# EAGLE design Tractive System Active Light rev2 (EAGLE 9.5.2)
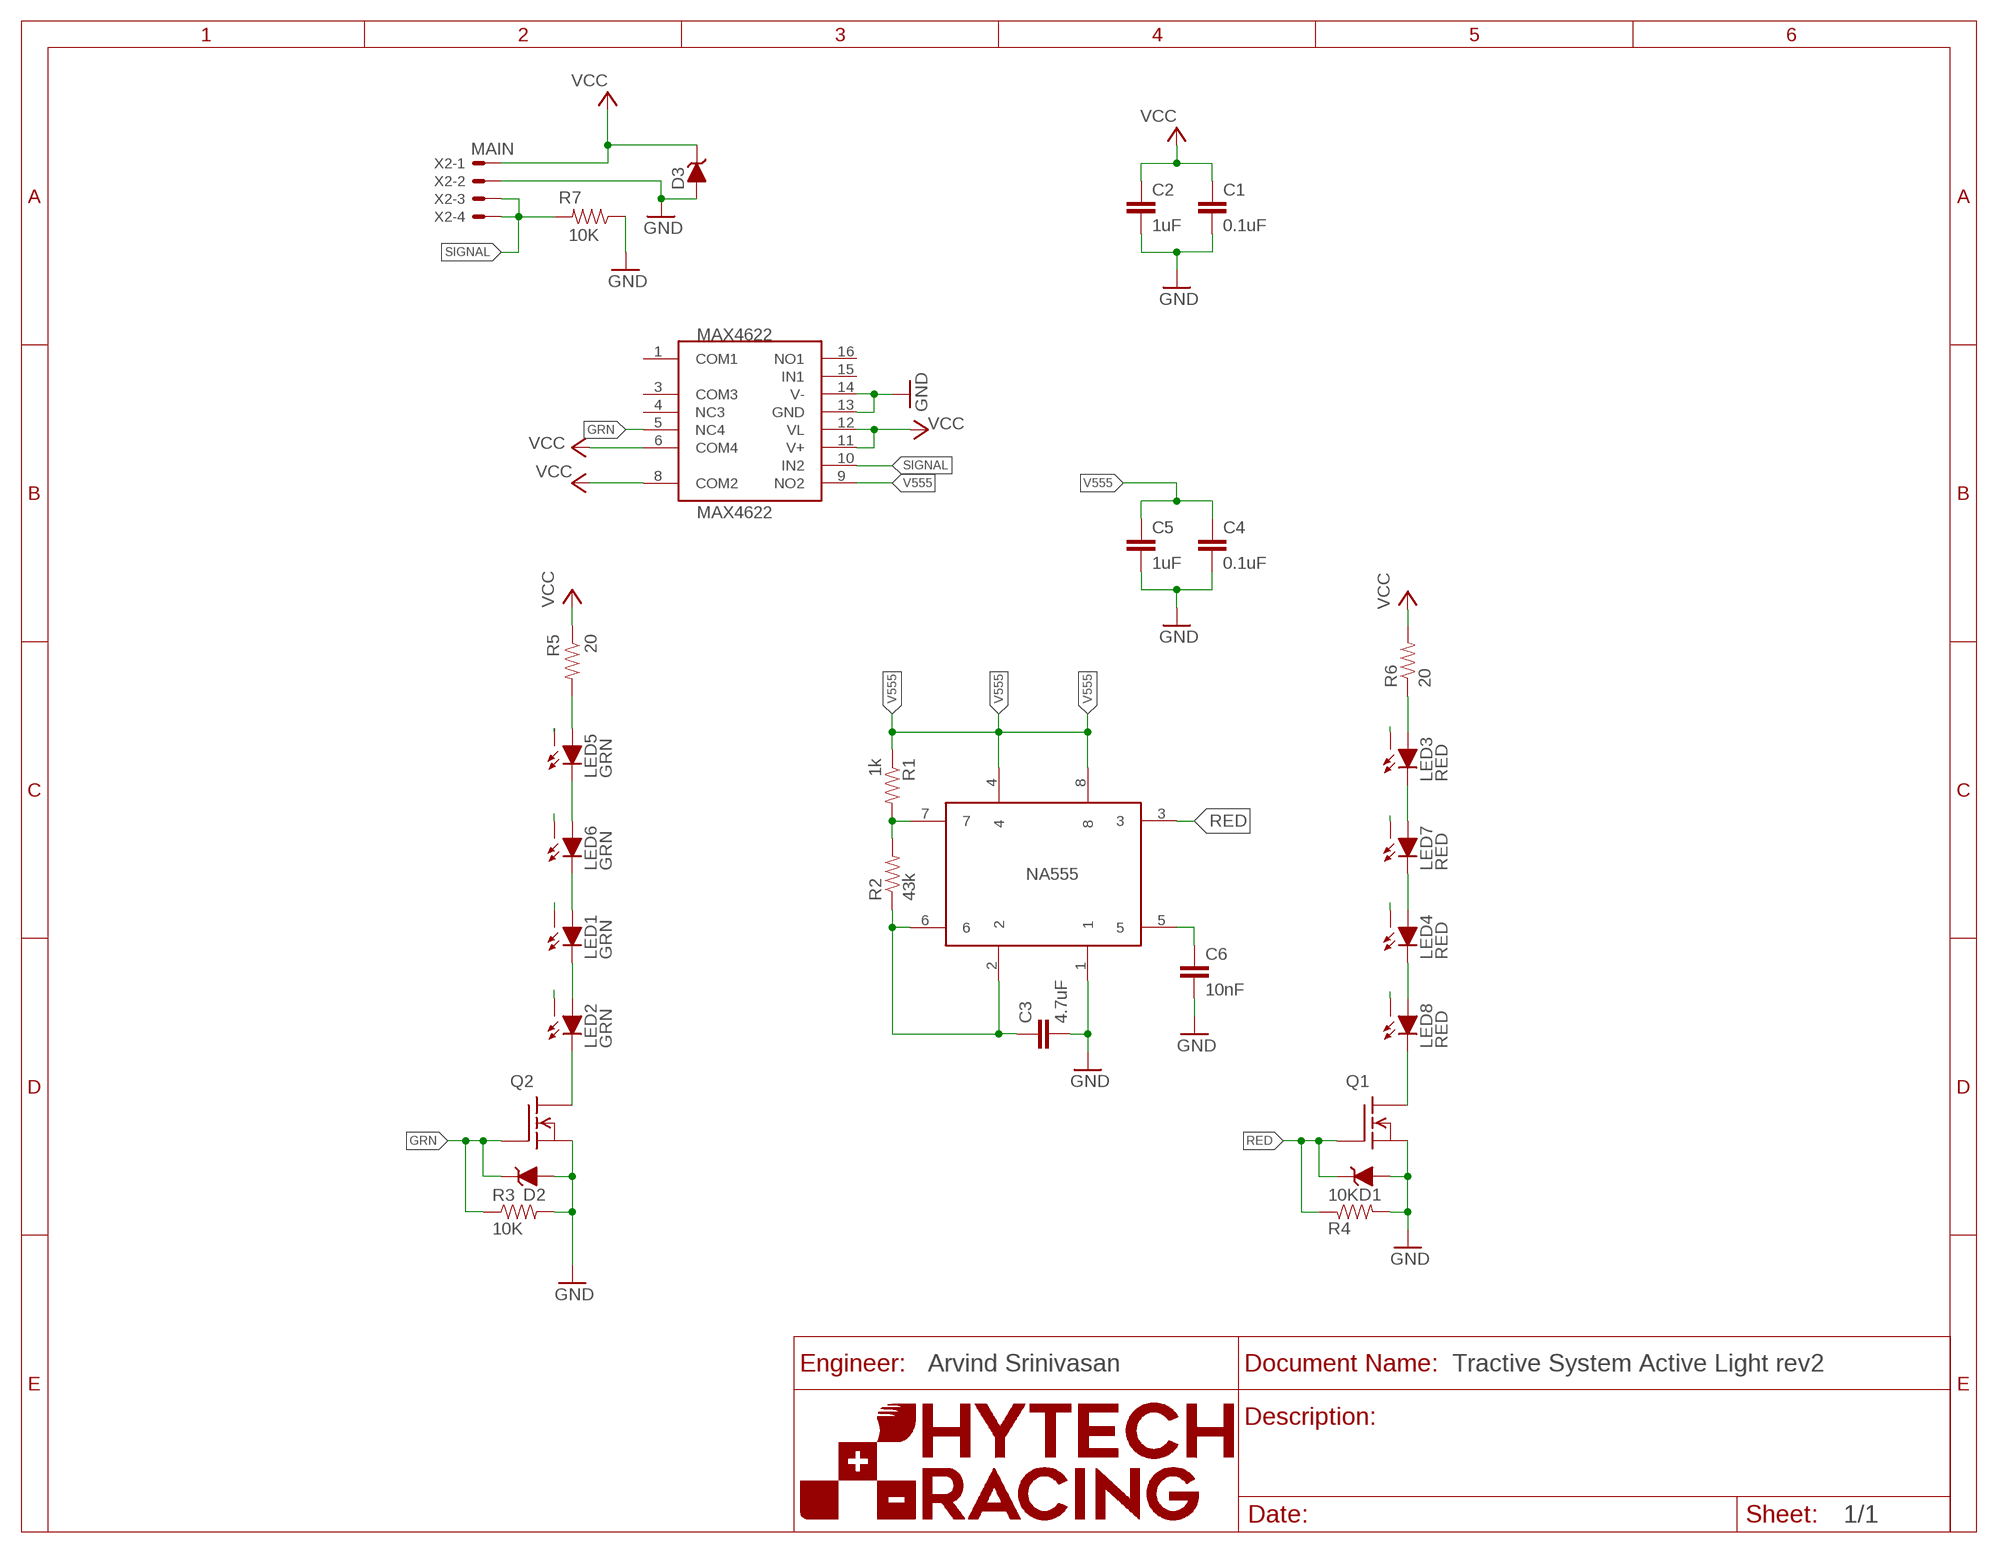
[diagram p0: schematic, sheet 1]
U$1 (FRAME_A_L): ORIENTATION: LANDSCAPE; SIZE: A

## Parts
C1  0.1uF  CAP0603-CAP  [0603-CAP]
C2  1uF  CAP0603-CAP  [0603-CAP]
C3  4.7uF  CAP0603-CAP  [0603-CAP]
C4  0.1uF  CAP0603-CAP  [0603-CAP]
C5  1uF  CAP0603-CAP  [0603-CAP]
C6  10nF  CAP0603-CAP  [0603-CAP]
D1  DIODE_ZENER  [SOT23]
D2  DIODE_ZENER  [SOT23]
D3  DIODE_ZENER0603  [0603_D]
LED1  GRN  XP-E2XP-E2  [XP-E2]
LED2  GRN  XP-E2XP-E2  [XP-E2]
LED3  RED  XP-E2XP-E2  [XP-E2]
LED4  RED  XP-E2XP-E2  [XP-E2]
LED5  GRN  XP-E2XP-E2  [XP-E2]
LED6  GRN  XP-E2XP-E2  [XP-E2]
LED7  RED  XP-E2XP-E2  [XP-E2]
LED8  RED  XP-E2XP-E2  [XP-E2]
MAX4622  MAX4622  [SO16]
NA555  NA555SO-8  [SOIC-08]
Q1  DMG3406LSOT  [SOT23]
Q2  DMG3406LSOT  [SOT23]
R1  1k  RESISTOR0603-RES  [0603-RES]
R2  43k  RESISTOR0603-RES  [0603-RES]
R3  10K  RESISTOR0603-RES  [0603-RES]
R4  10K  RESISTOR0603-RES  [0603-RES]
R5  20  RESISTOR0603-RES  [0603-RES]
R6  20  RESISTOR0603-RES  [0603-RES]
R7  10K  RESISTOR0603-RES  [0603-RES]
X2  MAIN  CONNECTOR-4NANO-FIT_RIGHT_ANGLE-4-SURFACE  [NANO-FIT_RIGHT_ANGLE-4-SURFACE]

## Nets
GND: C1.2 C2.2 C3.2 C4.2 C5.2 C6.2 D1.1(A) D2.1(A) D3.A MAX4622.13(GND) MAX4622.14(V-) NA555.1 Q1.2(S) Q2.2(S) R3.2 R4.2 R7.1 X2.2
GRN: D2.3(C) MAX4622.5(NC4) Q2.1(G) R3.1
N$1: LED1.A LED6.C
N$2: LED2.C Q2.3(D)
N$3: LED5.C LED6.A
N$5: LED5.A R5.2
N$8: C3.1 NA555.2 NA555.6 R2.1
N$9: NA555.7 R1.2 R2.2
N$10: LED8.C Q1.3(D)
N$11: LED3.A R6.1
N$13: C6.1 NA555.5
N$16: LED1.C LED2.A
N$17: LED3.C LED7.A
N$18: LED4.A LED7.C
N$19: LED4.C LED8.A
RED: D1.3(C) NA555.3 Q1.1(G) R4.1
SIGNAL: MAX4622.10(IN2) R7.2 X2.3 X2.4
THERM: LED1.X LED2.X LED3.X LED4.X LED5.X LED6.X LED7.X LED8.X
V555: C4.1 C5.1 MAX4622.9(NO2) NA555.4 NA555.8 R1.1
VCC: C1.1 C2.1 D3.C MAX4622.6(COM4) MAX4622.8(COM2) MAX4622.11(V+) MAX4622.12(VL) R5.1 R6.2 X2.1
Unconnected: MAX4622.1(COM1) MAX4622.3(COM3) MAX4622.4(NC3) MAX4622.15(IN1) MAX4622.16(NO1)

## Notes on the sheet
- Arvind Srinivasan

## Library data of the parts
C1-C6 = HyTechDevices:CAP: Capacitor Standard 0603 ceramic capacitor, and 0.1" leaded capacitor.; TOLERANCE: 5%; VOLTAGE: 25V
D1-D3 = HyTechDevices:DIODE_ZENER: ZENER DIODE
LED1-LED8 = HyTechDevices:XP-E2: XP-E2 high-brightness LED. Data sheet <https://www.cree.com/led-components/media/documents/XLampXPE2.pdf>
MAX4622 = HyTechDevices:MAX4622: Maxim Integrated MAX 4622 analogue switch. Data sheet <https://datasheets.maximintegrated.com/en/ds/MAX4621-MAX4623.pdf>
NA555 = HyTechDevices:NA555: Texas Instruments NA555 timer. Data sheet <http://www.ti.com/lit/ds/symlink/se555.pdf>
Q1 Q2 = HyTechDevices:DMG3406L: Generic NPN MOSFET DMG3406L (SOT-23, 2.8 A 30V)
R1-R7 = HyTechDevices:RESISTOR: Resistor Basic schematic elements and footprints for 0603, 1206, and PTH resistors.; TOLERANCE: 1%
X2 = HyTechDevices:CONNECTOR-4: Mini-Fit Junior connector 4 pole Source: http://www.molex.com

## Board
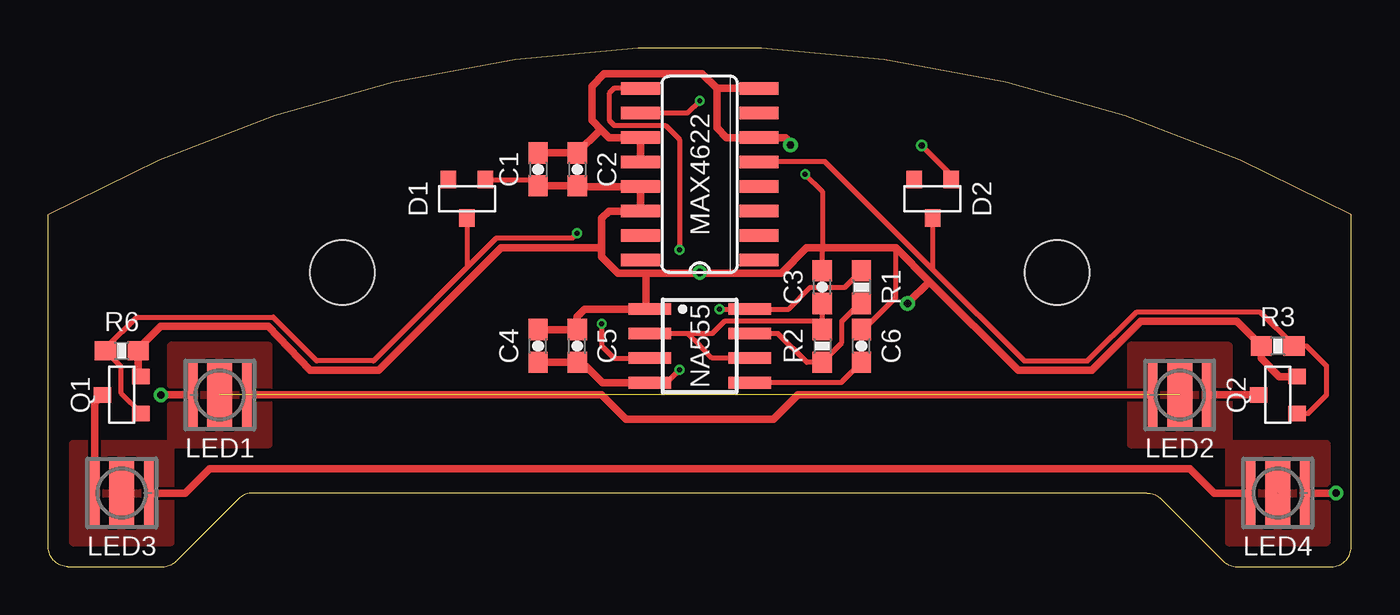
[diagram p1: board, top side]
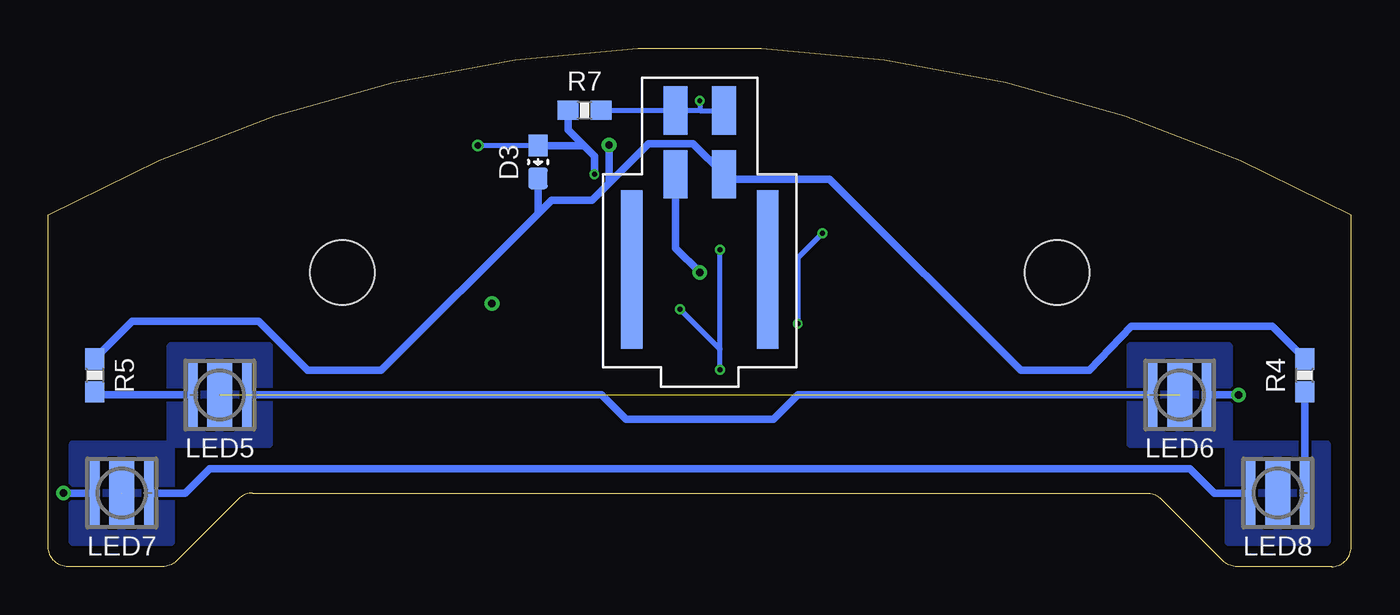
[diagram p2: board, bottom side, seen from below]

Size 67.51 x 26.85 mm. Coordinates in mm from the lower left corner, seen from the top.
Outline: 57.65,3.51 60.87,0.3 arc45 61.58,0 66.5,0 arc90 67.51,1.02 67.51,18.22 arc58 0,18.22 0,1.02 arc90 1.02,0 5.93,0 arc45 6.65,0.3 9.86,3.51 arc-45 10.58,3.81 56.93,3.81 arc-45 57.65,3.51
Copper layers (1*16): Top 0.035559375mm / dielectric 1.6mm / Bottom 0.035559375mm
Design rules "DRC Oshpark": minimum track width 6mil, minimum drill 10mil, track to track 6mil, track to pad 6mil, pad to pad 6mil, via to via 6mil, smd to smd 6mil, copper to edge 15mil, drill to drill 6mil, minimum pad ring 5mil, minimum via ring 5mil, stop-mask expansion 2.5mil, vias tented up to drill 30mil, thermal gap 10mil

### Footprints (pad centres in the part's own frame; a part is rotated, then mirrored left to right if it is on the bottom)
M3_MOUNTING = hole 3.353: 0,0
0603-CAP = smd 1.1 x 1: 1 -0.85,0; 2 0.85,0
SOT23 = smd 0.8 x 0.9: 1 -0.95,-1; 2 0.95,-1; 3 0,1
0603_D = smd 1.1 x 1: A -0.85,0; C 0.85,0
XP-E2 = smd 0.5 x 3.3: A -1.4,0; C 1.4,0 | smd 1.3 x 3.3: X 0,0
SO16 = smd 0.66 x 2.032: 1 -4.445,-3.073; 2 -3.175,-3.073; 3 -1.905,-3.073; 4 -0.635,-3.073; 5 0.635,-3.073; 6 1.905,-3.073; 7 3.175,-3.073; 8 4.445,-3.073; 9 4.445,3.073; 10 3.175,3.073; 11 1.905,3.073; 12 0.635,3.073; 13 -0.635,3.073; 14 -1.905,3.073; 15 -3.175,3.073; 16 -4.445,3.073
SOIC-08 = smd 0.6 x 2.2: 1 -1.905,-2.6; 2 -0.635,-2.6; 3 0.635,-2.6; 4 1.905,-2.6; 5 1.905,2.6; 6 0.635,2.6; 7 -0.635,2.6; 8 -1.905,2.6
0603-RES = smd 1.1 x 1: 1 -0.85,0; 2 0.85,0
NANO-FIT_RIGHT_ANGLE-4-SURFACE = smd 1.24 x 2.5: 1 1.25,0; 2 -1.25,0; 3 1.25,3.3; 4 -1.25,3.3 | smd 1.1 x 8.2: P$5 -3.52,-4.93; P$6 3.52,-4.93

### Placement (x,y rotation side)
$$U$1  [M3_MOUNTING]  15.24,15.24 0 top
C1  25.37,20.57 270 top
C2  27.41,20.57 270 top
C3  40.11,14.48 90 top
C4  25.37,11.43 90 top
C5  27.41,11.43 90 top
C6  42.14,11.43 90 top
D1  21.69,19.05 180 top
D2  45.82,19.05 180 top
D3  42.14,20.96 270 bottom
LED1  8.89,8.89 0 top
LED2  58.62,8.89 0 top
LED3  3.81,3.81 180 bottom
LED4  63.7,3.81 180 top
LED5  58.62,8.89 0 bottom
LED6  8.89,8.89 0 bottom
LED7  63.7,3.81 180 bottom
LED8  3.81,3.81 180 top
MAX4622  33.76,20.32 90 top
NA555  33.76,11.43 270 top
Q1  3.81,8.89 90 top
Q2  63.7,8.89 90 top
R1  42.14,14.48 270 top
R2  40.11,11.43 270 top
R3  63.7,11.43 180 top
R4  3.81,11.18 0 top
R5  65.1,9.91 270 bottom
R6  2.41,9.91 90 bottom
R7  39.73,23.63 0 bottom
U$2  [M3_MOUNTING]  52.27,15.24 0 top
X2  33.76,20.32 0 bottom

### Tracks (layer width: path | path; a pad name or v marks a point on that pad's centre or on a via)
GND  (via drill 0.25 pad 0.51, 0.35, 0.38 pad 0.76)
  Top 0.254: v39.22,20.32 40.11,19.43 40.11,16.51 C3.2 | 43.92,16.51 43.92,13.96 42.24,12.28 C6.2 | D1.1 25.33,20.05 25.66,19.72 | v45.26,21.81 46.77,20.3 D2.1
  Top 0.381: 45.66,14.77 50.27,10.16 54.08,10.16 56.62,12.7 61.58,12.7 R3.2 62.85,10.78 63.79,9.84 Q2.2 | 45.66,14.77 43.92,16.51 40.11,16.51 39.3,16.51 37.99,15.2 33.76,15.2 | 28.68,16.51 23.47,16.51 17.12,10.16 13.56,10.16 11.39,12.45 5.82,12.45 4.55,11.18 R4.2 4.66,9.99 Q1.2 | 30.96,15.2 29.53,15.2 28.68,16.05 28.68,16.51 | 30.96,15.2 33.76,15.2 | 33.76,15.2 v33.76,15.24 | 28.68,16.51 28.68,18.03 29.06,18.41 MAX4622.14 MAX4622.13 27.45,19.68 C2.2 25.66,19.72 C1.2 | 30.96,15.2 30.96,13.53 NA555.1 27.79,13.34 27.41,12.95 C5.2 C4.2 | 45.66,14.77 | 45.66,14.77 v44.52,13.63
  Bottom 0.254: X2.2 | D3.A v45.26,21.81
  Bottom 0.381: X2.2 35.02,16.5 v33.76,15.24 | v39.22,20.32 39.22,21.27 39.76,21.81 | R7.1 40.58,22.63 39.76,21.81 | D3.A 39.76,21.81
GRN
  Top 0.254: 45.82,15.4 50.57,10.65 53.85,10.65 56.37,13.17 62.81,13.17 R3.1 65.19,11.43 66.24,10.38 66.24,8.89 65.29,7.94 Q2.1 | 45.82,15.4 40.25,20.98 37.36,20.98 37.34,20.95 MAX4622.5 | D2.3 45.82,15.4
N$1  (via drill 0.38 pad 0.76)
  Top 0.381: v5.84,8.89 LED6.C
  Bottom 0.381: LED6.C v5.84,8.89
N$2
  Top 0.381: Q2.3 LED2.C
N$3
  Bottom 0.381: LED6.A 28.68,8.89 29.95,7.62 37.57,7.62 38.84,8.89 LED5.C
N$5
  Bottom 0.381: R5.2 64.94,8.89 LED5.A
N$8
  Top 0.254: C3.1 R2.1 39.69,12.7 35.03,12.7 34.39,12.06 33.12,12.06 | NA555.6 34.39,10.79 33.76,11.43 33.12,12.06 | 33.12,12.06 NA555.2
N$9
  Top 0.254: R1.2 42.04,13.63 41.12,12.71 41.12,11.6 R2.2 39.31,10.58 37.82,12.06 NA555.7
N$10
  Top 0.381: LED8.C 2.41,8.49 Q1.3
N$11
  Bottom 0.381: R6.1 LED3.A
N$13
  Top 0.254: C6.1 41.08,9.52 NA555.5
N$16
  Top 0.381: LED1.C 28.68,8.89 29.95,7.62 37.57,7.62 38.84,8.89 LED2.A
N$17
  Bottom 0.381: LED7.A 60.43,3.81 59.16,5.08 8.36,5.08 7.09,3.81 LED3.C
N$18  (via drill 0.38 pad 0.76)
  Top 0.381: LED4.A v66.73,3.81
  Bottom 0.381: v66.73,3.81 LED4.A
N$19
  Top 0.381: LED4.C 60.43,3.81 59.16,5.08 8.36,5.08 7.09,3.81 LED8.A
RED  (via drill 0.25 pad 0.51)
  Top 0.254: 21.69,15.49 23.22,17.02 27.15,17.02 v27.41,17.27 | v28.68,12.57 28.68,11.43 29.31,10.79 NA555.3 | Q1.1 3.78,8.96 3.78,10.35 R4.1 2.96,11.3 4.57,12.92 11.65,12.92 13.92,10.65 16.85,10.65 21.55,15.36 21.69,15.49 | D1.3 21.69,15.49
  Bottom 0.254: v27.41,17.27 28.68,16 v28.68,12.57
SIGNAL  (via drill 0.25 pad 0.51)
  Top 0.254: MAX4622.10 33.12,23.49 v33.76,24.13
  Bottom 0.254: v33.76,24.13 33.76,23.62 | 33.76,23.62 X2.4 35.02,23.63 R7.2 | 33.76,23.62 33.75,23.62 X2.3
THERM  (3 unrouted)
  pour Top: 6.35,1.27 6.35,6.35 1.27,6.35 1.27,1.27
  pour Top: 6.35,6.35 11.43,6.35 11.43,11.43 6.35,11.43
  pour Top: 56.08,11.43 56.08,6.35 61.16,6.35 61.16,11.43
  pour Top: 66.24,1.27 66.24,6.35 61.16,6.35 61.16,1.27
  pour Bottom: 66.24,1.27 66.24,6.35 61.16,6.35 61.16,1.27
  pour Bottom: 61.16,6.35 61.16,11.43 56.08,11.43 56.08,6.35
  pour Bottom: 11.43,6.35 11.43,11.43 6.35,11.43 6.35,6.35
  pour Bottom: 6.35,1.27 6.35,6.35 1.27,6.35 1.27,1.27
V555  (via drill 0.25 pad 0.51)
  Top 0.254: 27.87,10.37 27.66,10.58 C5.1 | NA555.4 32.04,9.52 v32.71,10.19 | R1.1 41.27,14.46 39.49,14.46 38.37,13.34 NA555.8 v34.77,13.34 | MAX4622.9 29.31,24.77 29.06,24.51 29.06,23.12 29.32,22.86 31.98,22.86 32.71,22.13 v32.71,16.42
  Top 0.381: NA555.4 28.72,9.52 27.87,10.37 | C5.1 C4.1
  Bottom 0.254: v32.71,10.19 32.71,11.27 | 32.71,11.27 v34.77,13.34 | 32.71,11.27 v32.71,16.42
VCC  (via drill 0.38 pad 0.76)
  Top 0.381: C1.1 C2.1 28.59,22.61 28.68,22.61 | 28.68,22.61 29.06,22.22 MAX4622.11 MAX4622.12 | 28.68,22.61 28.17,23.11 28.17,24.89 28.8,25.53 33.88,25.53 34.65,24.77 | MAX4622.8 34.65,24.77 | 34.65,24.77 34.65,22.73 35.15,22.22 MAX4622.6 38.2,22.22 38.46,21.97 v38.46,21.84
  Bottom 0.381: 42.14,18.29 41.44,18.98 39.34,18.98 38.46,19.86 | 42.14,18.29 50.27,10.16 54.08,10.16 56.62,12.7 63.16,12.7 R5.1 | R6.2 4.1,12.45 11.39,12.45 13.56,10.16 17.12,10.16 27.03,20.07 32.25,20.07 X2.1 34.1,21.91 36.41,21.91 38.46,19.86 | v38.46,21.84 38.46,19.86 | D3.C 42.14,18.29

### Text on the board
tDocu: HyTech Racing 2020 / Tractive System Active Light rev2
bDocu: Designed by / Arvind Srinivasan, / Max Zhelyabovskiy | HyTech Racing 2020 / Tractive System Active Light rev2